# EAGLE design LB-BIT-i1-slideSwitch-v02(rev1) (EAGLE 6.6.0)
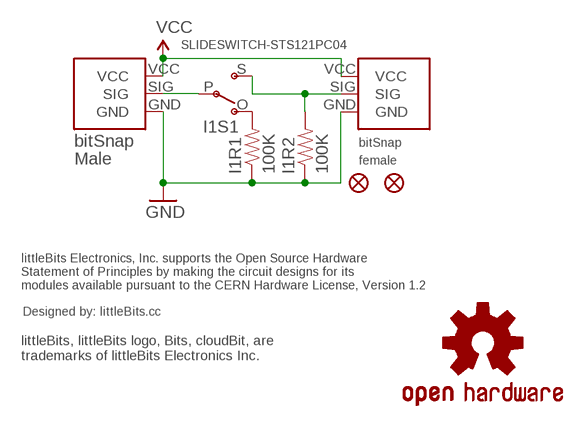
[diagram p0: schematic, sheet 1]

## Parts
I1BSF  BITSNAP_FEMALE  [BITSNAP_FEMALE]
I1BSM  BITSNAP_MALE  [BITSNAP_MALE]
I1FD1  FIDUCIAL1X2  [FIDUCIAL-1X2]
I1FD2  FIDUCIAL1X2  [FIDUCIAL-1X2]
I1R1  100K  RESISTOR0603-RES  [0603-RES]
I1R2  100K  RESISTOR0603-RES  [0603-RES]
I1S1  SLIDESWITCH-STS121PC04  [SLIDESWITCH-STS121PC04]
U$1  OSHWCREDIT  [OSHWCREDIT]
U$2  OSHW-LOGOS  [OSHW-LOGO-S]

## Nets
GND: I1BSF.GND I1BSM.GND I1R1.1 I1R2.1
N$1: I1BSF.SIG I1R2.2 I1S1.S
N$3: I1BSM.SIG I1S1.P
N$4: I1R1.2 I1S1.O
VCC: I1BSF.VCC I1BSM.VCC

## Library data of the parts
I1BSF = bitSnap:BITSNAP_FEMALE
I1BSM = bitSnap:BITSNAP_MALE
I1FD1 I1FD2 = SparkFun:FIDUCIAL: Fiducial Alignment Points Various fiducial points for machine vision alignment.
I1R1 I1R2 = SparkFun:RESISTOR: Resistor Basic schematic elements and footprints for 0603, 1206, and PTH 1/10th watt (small) resistors.
I1S1 = LITTLEBITS:SLIDESWITCH-STS121PC04
U$1 = LITTLEBITS:OSHWCREDIT
U$2 = LITTLEBITS:OSHW-LOGO: Open Source Hardware Logo This logo indicates the piece of hardware it is found on incorporates a OSHW license and/or adheres to the definition of open source hardware found here: http://freedomdefined.org/OSHW

## Board
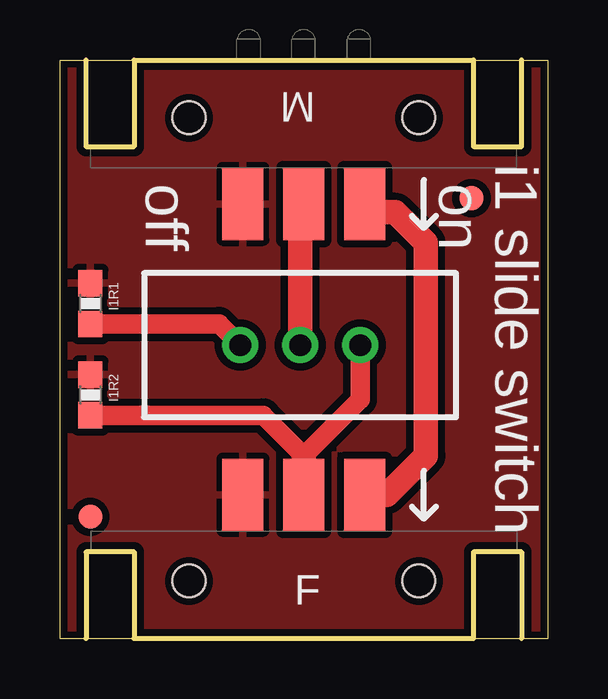
[diagram p1: board, top side]
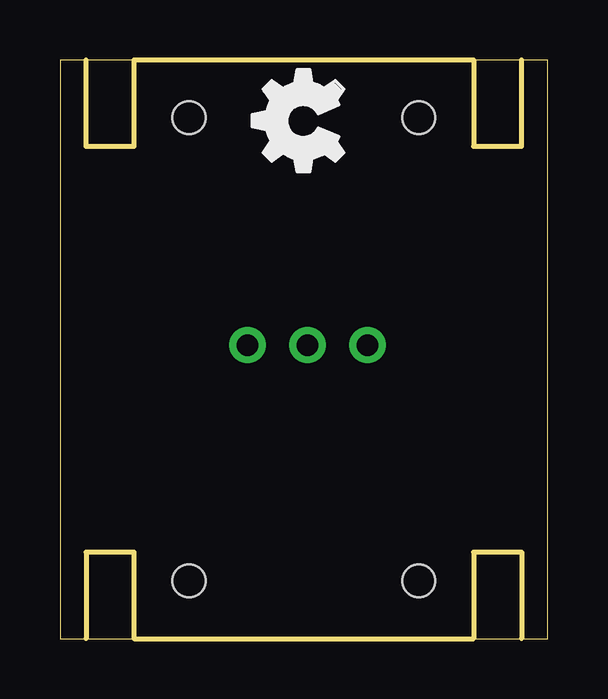
[diagram p2: board, bottom side, seen from below]

Size 20.32 x 24.13 mm. Coordinates in mm from the lower left corner, seen from the top.
Outline: 0,0 0,24.13 20.32,24.13 20.32,0 0,0
Copper layers (1*16): Top 0.035mm / dielectric 1.5mm / Bottom 0.035mm
Design rules "default": minimum track width 8mil, minimum drill 20mil, track to track 8mil, track to pad 8mil, pad to pad 8mil, via to via 8mil, smd to smd 8mil, copper to edge 10mil, drill to drill 8mil, minimum pad ring 12mil, minimum via ring 10mil, stop-mask expansion 4mil, vias tented up to drill 25mil, thermal gap 10mil

### Footprints (pad centres in the part's own frame; a part is rotated, then mirrored left to right if it is on the bottom)
BITSNAP_FEMALE = smd 1.7 x 3: GND 6.35,6; SIG 8.89,6; VCC 11.43,6 | hole 1.37: 13.68,2.41; 4.1,2.41
BITSNAP_MALE = smd 1.7 x 3: GND 11.43,6; SIG 8.89,6; VCC 6.35,6 | hole 1.37: 13.68,2.41; 4.1,2.41
FIDUCIAL-1X2 = smd 1 x 1: 1 0,0
0603-RES = smd 1.1 x 1: 1 -0.85,0; 2 0.85,0
SLIDESWITCH-STS121PC04 = drill 0.9: O 9,3; P 6.5,3; S 4,3

### Placement (x,y rotation side)
I1BSF  1.27,0 0 top
I1BSM  19.05,24.13 180 top
I1FD1  1.27,5.08 0 top
I1FD2  17.15,18.37 0 top
I1R1  1.27,13.97 270 top
I1R2  1.27,10.16 270 top
I1S1  16.51,15.24 180 top
U$1  -9,-20 0 top  (outside the outline)
U$2  -13,-15 0 top  (outside the outline)
U$6  [OSHW_FILLX150_NOTEXT]  8.5,18.64 0 top

### Tracks (layer width: path | path; a pad name or v marks a point on that pad's centre or on a via)
GND
  Top 1.016: I1BSF.GND 7.51,6.11 | 7.27,6.35 I1BSF.GND | I1BSF.GND 7.62,6.35
  pour Top (isolate 0.305): 0,24.13 20.32,24.13 20.32,0 0,0
N$1
  Top 0.406: 10.13,6.32 10.16,6.35
  Top 0.813: I1S1.S 12.51,9.97 10.16,7.62 8.47,9.31 I1R2.2
  Top 1.016: I1BSF.SIG 10.16,6.35 10.16,7.62
N$3
  Top 0.813: 9.99,11.93 I1S1.P
  Top 1.016: I1S1.P 10.01,17.98 I1BSM.SIG
N$4
  Top 0.406: 7.49,12.26 I1S1.O
  Top 0.813: I1R1.2 6.63,13.12 I1S1.O
VCC
  Top 1.016: I1BSF.VCC 13.62,6 15.24,7.62 15.24,16.51 13.97,17.78 13.05,17.78 I1BSM.VCC

### Text on the board
tPlace: i1 slide switch | off | on